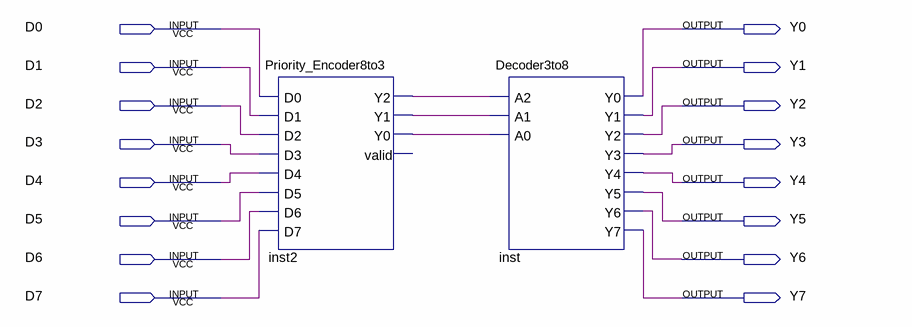
[diagram p0: schematic sheet]
// Quartus schematic Encoder_Decoder_Block_diagram.bdf as structural Verilog: 2 symbols, 16 pins
module Encoder_Decoder_Block_diagram (
  input  D0,
  input  D1,
  input  D2,
  input  D3,
  input  D4,
  input  D5,
  input  D6,
  input  D7,
  output Y0,
  output Y1,
  output Y2,
  output Y3,
  output Y4,
  output Y5,
  output Y6,
  output Y7
);

  wire inst2_y0, inst2_y1, inst2_y2;

  Priority_Encoder8to3 inst2 (
    .D0(D0), .D1(D1), .D2(D2), .D3(D3), .D4(D4), .D5(D5), .D6(D6), .D7(D7), .Y2(inst2_y2), .Y1(inst2_y1),
    .Y0(inst2_y0));  // open: valid
  Decoder3to8 inst (
    .A2(inst2_y2), .A1(inst2_y1), .A0(inst2_y0), .Y0(Y0), .Y1(Y1), .Y2(Y2), .Y3(Y3), .Y4(Y4), .Y5(Y5),
    .Y6(Y6), .Y7(Y7));
endmodule
